# Altium project HBN_Portable_Charger.PrjPcb
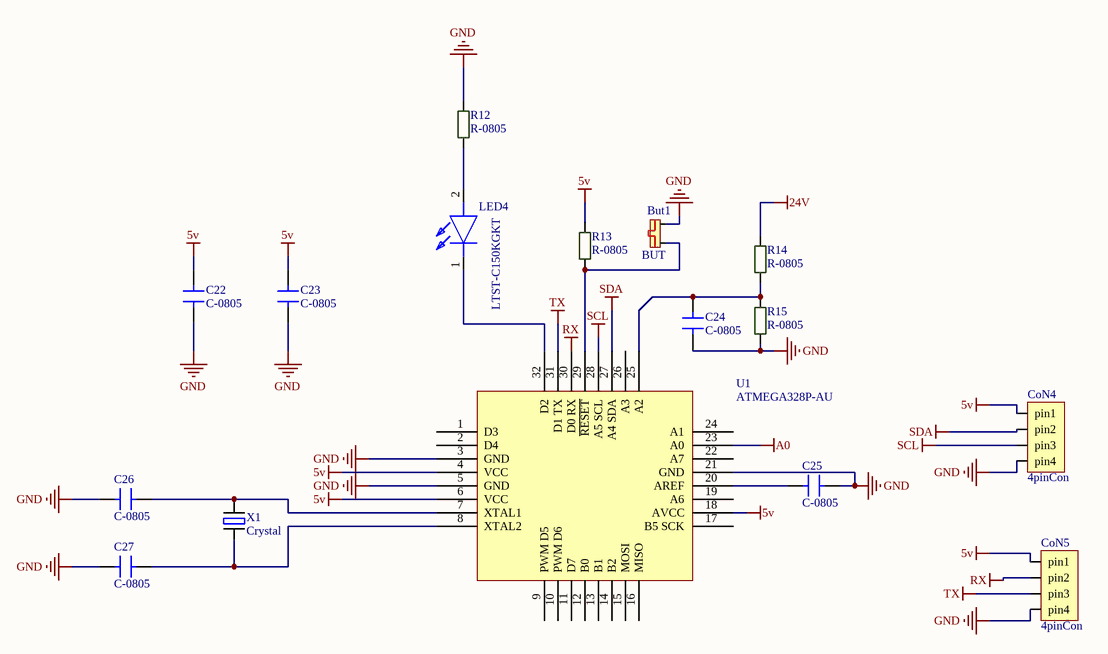
[diagram p0: MCU.SchDoc]
4 sheets, 207 parts. Net scope: global (net labels, ports and power ports of the same name join across sheets).
Board file: Layout.PcbDoc
Sheets:
  MCU.SchDoc
  Inverter.SchDoc
  Power Distrubition.SchDoc
  USB Charger.SchDoc

## Sheet MCU.SchDoc
size A4; SheetNumber: 1; SheetTotal: 4

### Parts
But1  BUT  [ButTON]
C22  C-0805  [C-0805W]
C23  C-0805  [C-0805W]
C24  C-0805  [C-0805W]
C25  C-0805  [C-0805W]
C26  C-0805  [C-0805W]
C27  C-0805  [C-0805W]
CoN4  4pinCon  [4pinCon]
CoN5  4pinCon  [4pinCon]
LED4  LTST-C150KGKT  [LED1206]
R12  R-0805  [R-0805W]
R13  R-0805  [R-0805W]
R14  R-0805  [R-0805W]
R15  R-0805  [R-0805W]
U1  ATMEGA328P-AU  [TQFP80P900X900X120-32N]
X1  Crystal  [crystal]

### Nets
5v: C22.2 C23.2 CoN4.1(pin1) CoN5.1(pin1) R13.2 U1.4(VCC) U1.6(VCC) U1.18(AVCC)
24V: R14.2
A0: U1.23(A0)
GND: But1.2 C22.1 C23.1 C24.1 C25.2 C26.1 C27.1 CoN4.4(pin4) CoN5.4(pin4) R12.2 R15.1 U1.3(GND) U1.5(GND) U1.21(GND)
RX: CoN5.2(pin2) U1.30(D0_RX)
SCL: CoN4.3(pin3) U1.28(A5_SCL)
SDA: CoN4.2(pin2) U1.27(A4_SDA)
TX: CoN5.3(pin3) U1.31(D1_TX)
NetBut1_1: But1.1 R13.1 U1.29(~{RESET})
NetC24_2: C24.2 R14.1 R15.2 U1.25(A2)
NetC25_1: C25.1 U1.20(AREF)
NetC26_2: C26.2 U1.7(XTAL1) X1.1
NetC27_2: C27.2 U1.8(XTAL2) X1.2
NetLED4_1: LED4.1(K) U1.32(D2)
NetLED4_2: LED4.2(A) R12.1

Not connected (* = marked no-connect by the designer): U1 1(D3) 2(D4) 9(PWM_D5) 10(PWM_D6) 11(D7) 12(B0) 13(B1) 14(B2) 15(MOSI) 16(MISO) 17(B5_SCK) 19(A6) 22(A7) 24(A1) 26(A3)

### Library data of the parts
LED4 = LTST-C150KGKT: LED; Manufacturer_Name: Lite-On; Datasheet Link: http://optoelectronics.liteon.com/upload/download/ds22-2000-072/ltst-c150kgkt.pdf; Height: 1.2mm; Manufacturer_Part_Number: LTST-C150KGKT; Mouser Part Number: 859-LTST-C150KGKT; Mouser Price/Stock: https://www.mouser.com/Search/Refine.aspx?Keyword=859-LTST-C150KGKT; RS Part Number: 6920871; RS Price/Stock: https://uk.rs-online.com/web/p/products/6920871
U1 = ATMEGA328P-AU: Microchip Technology ATMEGA328P-AN, 8bit AVR Microcontroller, 20MHz, 32 kB Flash, 32-Pin TQFP
X1 = Crystal: AS49SD-16M-FC160F3-TR

## Sheet Inverter.SchDoc
size A4; SheetNumber: 2; SheetTotal: 4
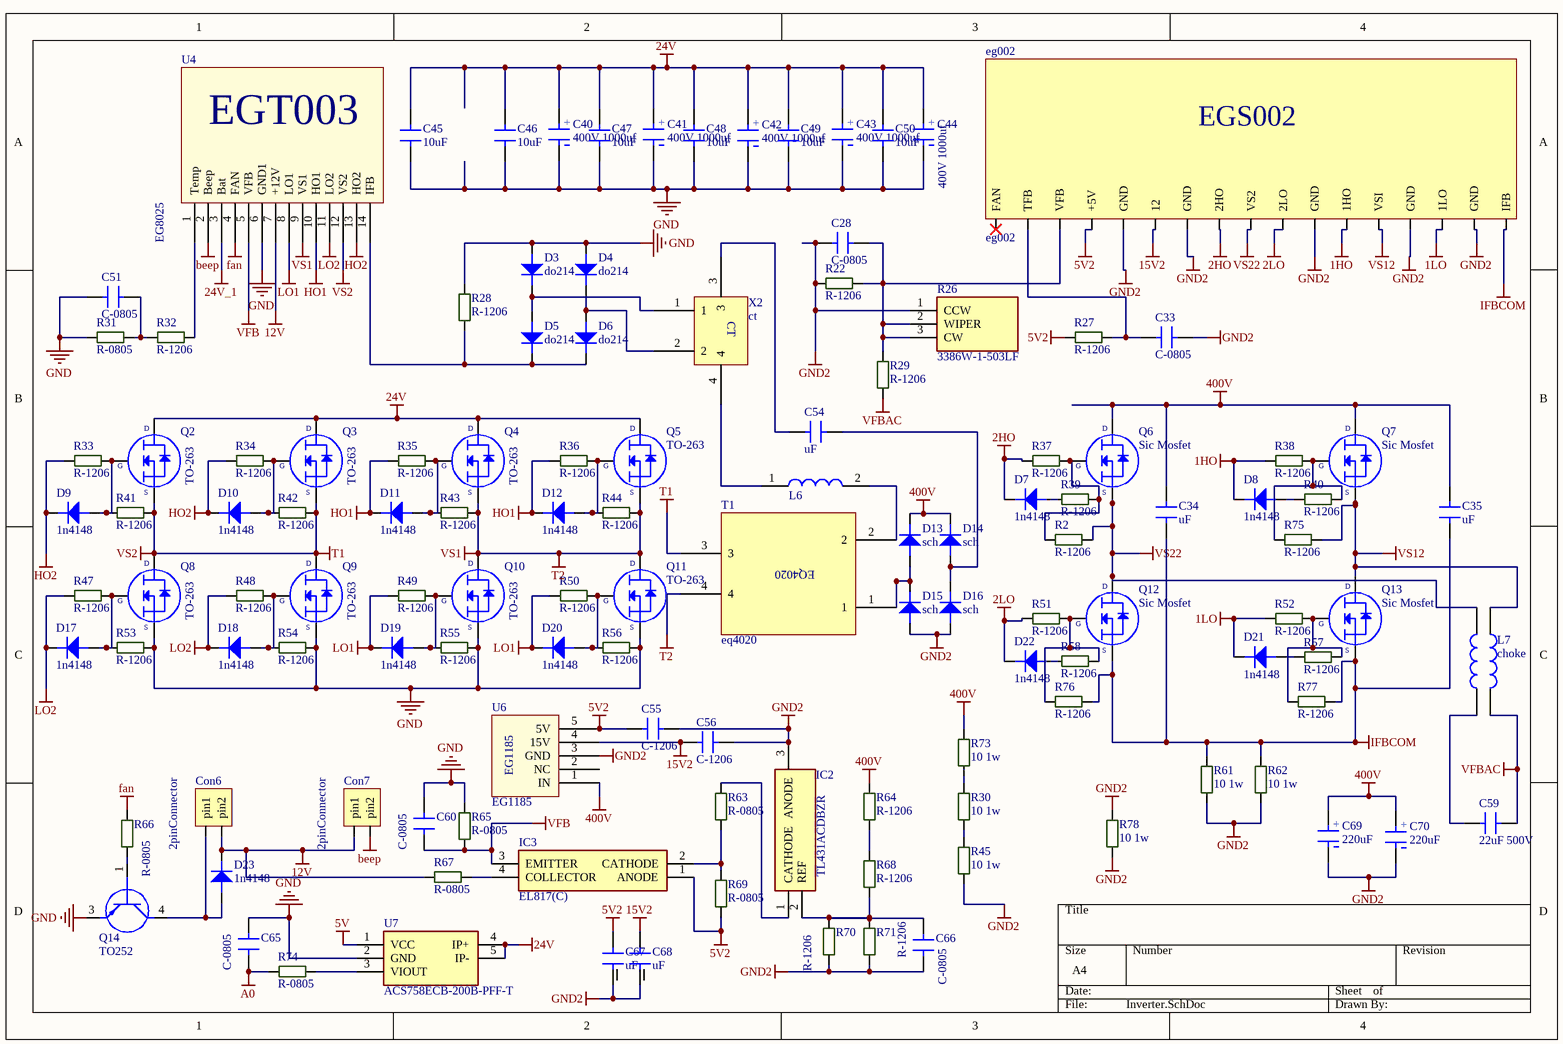
[diagram p1: Inverter.SchDoc]

### Parts
C28  C-0805  [C-0805W]
C33  C-0805  [C-0805W]
C34  uF  [680nF bulk]
C35  uF  [680nF bulk]
C40  400V 1000uf  [CAP_EEETC1C331V]
C41  400V 1000uf  [CAP_EEETC1C331V]
C42  400V 1000uf  [CAP_EEETC1C331V]
C43  400V 1000uf  [CAP_EEETC1C331V]
C44  400V 1000uf  [CAP_EEETC1C331V]
C45  10uF  [C-2220R]
C46  10uF  [C-2220R]
C47  10uF  [C-2220R]
C48  10uF  [C-2220R]
C49  10uF  [C-2220R]
C50  10uF  [C-2220R]
C51  C-0805  [C-0805W]
C54  uF  [680nF bulk]
C55  C-1206  [C-1206W]
C56  C-1206  [C-1206W]
C59  22uF 500V  [CAP.POL 22UF 500VDC - duplicate]
C60  C-0805  [C-0805W]
C65  C-0805  [C-0805W]
C66  C-0805  [C-0805W]
C67  uF  [CapSmdElc]
C68  uF  [CapSmdElc]
C69  220uF  [Koshin]
C70  220uF  [Koshin]
Con6  2pinConnector  [2pinCon]
Con7  2pinConnector  [2pinCon]
D3  do214  [DO-214AC]
D4  do214  [DO-214AC]
D5  do214  [DO-214AC]
D6  do214  [DO-214AC]
D7  1n4148  [SOD123]
D8  1n4148  [SOD123]
D9  1n4148  [SOD123]
D10  1n4148  [SOD123]
D11  1n4148  [SOD123]
D12  1n4148  [SOD123]
D13  sch  [DPAK_TO263 - sch]
D14  sch  [DPAK_TO263 - sch]
D15  sch  [DPAK_TO263 - sch]
D16  sch  [DPAK_TO263 - sch]
D17  1n4148  [SOD123]
D18  1n4148  [SOD123]
D19  1n4148  [SOD123]
D20  1n4148  [SOD123]
D21  1n4148  [SOD123]
D22  1n4148  [SOD123]
D23  1n4148  [SOD123]
eg002  eg002  [eg002]
IC2  TL431ACDBZR  [SOT95P237X112-3N]
IC3  EL817(C)  [DIP762W60P254L458H480Q4N]
L6  inducter_SMPI06050  [inductor]  (value not drawn)
L7  choke  [choke]
Q2  TO-263  [DPAK_TO263]
Q3  TO-263  [DPAK_TO263]
Q4  TO-263  [DPAK_TO263]
Q5  TO-263  [DPAK_TO263]
Q6  Sic Mosfet  [247]
Q7  Sic Mosfet  [247]
Q8  TO-263  [DPAK_TO263]
Q9  TO-263  [DPAK_TO263]
Q10  TO-263  [DPAK_TO263]
Q11  TO-263  [DPAK_TO263]
Q12  Sic Mosfet  [247]
Q13  Sic Mosfet  [247]
Q14  TO252  [D-PAK_TO252AA]
R2  R-1206  [R-1206W]
R22  R-1206  [R-1206W]
R26  3386W-1-503LF  [3386W]
R27  R-1206  [R-1206W]
R28  R-1206  [R-1206W]
R29  R-1206  [R-1206W]
R30  10 1w  [R-2512W]
R31  R-0805  [R-0805W]
R32  R-1206  [R-1206W]
R33  R-1206  [R-1206W]
R34  R-1206  [R-1206W]
R35  R-1206  [R-1206W]
R36  R-1206  [R-1206W]
R37  R-1206  [R-1206W]
R38  R-1206  [R-1206W]
R39  R-1206  [R-1206W]
R40  R-1206  [R-1206W]
R41  R-1206  [R-1206W]
R42  R-1206  [R-1206W]
R43  R-1206  [R-1206W]
R44  R-1206  [R-1206W]
R45  10 1w  [R-2512W]
R47  R-1206  [R-1206W]
R48  R-1206  [R-1206W]
R49  R-1206  [R-1206W]
R50  R-1206  [R-1206W]
R51  R-1206  [R-1206W]
R52  R-1206  [R-1206W]
R53  R-1206  [R-1206W]
R54  R-1206  [R-1206W]
R55  R-1206  [R-1206W]
R56  R-1206  [R-1206W]
R57  R-1206  [R-1206W]
R58  R-1206  [R-1206W]
R61  10 1w  [R-2512W]
R62  10 1w  [R-2512W]
R63  R-0805  [R-0805W]
R64  R-1206  [R-1206W]
R65  R-0805  [R-0805W]
R66  R-0805  [R-0805W]
R67  R-0805  [R-0805W]
R68  R-1206  [R-1206W]
R69  R-0805  [R-0805W]
R70  R-1206  [R-1206W]
R71  R-1206  [R-1206W]
R73  10 1w  [R-2512W]
R74  R-0805  [R-0805W]
R75  R-1206  [R-1206W]
R76  R-1206  [R-1206W]
R77  R-1206  [R-1206W]
R78  10 1w  [R-2512W]
T1  eq4020  [eq4020]
U4  EG8025  [EGT003]
U6  EG1185  [EG1185]
U7  ACS758ECB-200B-PFF-T  [ACS756SCA-050B-PFF-T_2]
X2  ct  [ct]

### Nets
1HO: D8.k eg002.6(1HO) R38.1
1LO: D21.k eg002.3(1LO) R52.1
2HO: D7.k eg002.10(2HO) R37.1
2LO: D22.k eg002.8(2LO) R51.1
5v: U7.1(VCC)
5V2: C55.1 C67.1 eg002.14(+5V) IC3.1(ANODE) R27.1 R69.1 U6.5(5V)
12V: Con6.2(pin2) Con7.1(pin1) D23.k R67.1 U4.7(+12V)
15V2: C56.1 C68.1 eg002.12 U6.4(15V)
24V: C40.1 C41.1 C42.1 C43.1 C44.1 C45.1 C46.1 C47.1 C48.1 C49.1 C50.1 Q2.3 Q3.3 Q4.3 Q5.3 U7.4(IP+) U7.5(IP-)
24V_1: U4.3(Bat)
400V: C34.2 C35.2 C69.2 C70.2 D13.2 D14.2 Q6.2 Q7.2 R64.2 R73.2 U6.1(IN)
A0: C65.1 R74.2
beep: Con7.2(pin2) U4.2(Beep)
fan: R66.1 U4.4(FAN)
GND: C40.2 C41.2 C42.2 C43.2 C44.2 C45.2 C46.2 C47.2 C48.2 C49.2 C50.2 C51.1 C60.2 C65.2 D3.a D4.a Q8.2 Q9.2 Q10.2 Q11.2 Q14.3(E) R28.2 R31.1 R53.2 R54.2 R55.2 R56.2 R65.2 U4.6(GND1) U7.2(GND)
GND2: C28.1 C33.2 C55.2 C56.2 C66.1 C67.2 C68.2 C69.1 C70.1 D15.1 D16.1 eg002.2(GND) eg002.4(GND) eg002.7(GND) eg002.11(GND) eg002.13(GND) IC2.3(ANODE) R22.2 R26.1(CCW) R45.1 R61.1 R62.1 R70.1 R71.1 R78.1 R78.2 U6.3(GND)
HO1: D11.k D12.k R35.1 R36.1 U4.10(HO1)
HO2: D9.k D10.k R33.1 R34.1 U4.13(HO2)
IFBCOM: C34.1 C35.1 eg002.1(IFB) Q12.3 Q13.3 R61.2 R62.2 R76.1 R77.1
LO1: D19.k D20.k R49.1 R50.1 U4.8(LO1)
LO2: D17.k D18.k R47.1 R48.1 U4.11(LO2)
T1: Q2.2 Q3.2 Q8.3 Q9.3 R41.2 R42.2 T1.3 U4.12(VS2)  [also labelled VS2]
T2: Q4.2 Q5.2 Q10.3 Q11.3 R43.2 R44.2 T1.4 U4.9(VS1)  [also labelled VS1]
VFB: C60.1 IC3.3(EMITTER) R65.1 U4.5(VFB)
VFBAC: C59.2 L7.3 R29.1
VS12: eg002.5(VSI) L7.1 Q7.3 Q13.2 R75.1
VS22: eg002.9(VS2) L7.2 Q6.3 Q12.2 R2.1
NetC28_2: C28.2 eg002.15(VFB) R22.1 R26.2(WIPER) R26.3(CW) R29.2
NetC33_1: C33.1 eg002.16(TFB) R27.2
NetC51_2: C51.2 R31.2 R32.1
NetC54_1: C54.1 X2.3
NetC54_2: C54.2 D14.1 D16.2
NetC59_1: C59.1 L7.4
NetC66_2: C66.2 IC2.2(REF) R68.1 R70.2 R71.2
NetCon6_1: Con6.1(pin1) D23.a Q14.4(C)
NetD3_k: D3.k D5.a X2.1
NetD4_k: D4.k D6.a X2.2
NetD5_k: D5.k D6.k R28.1 U4.14(IFB)
NetD7_a: D7.a R39.1
NetD8_a: D8.a R40.1
NetD9_a: D9.a Q2.1 R33.2 R41.1
NetD10_a: D10.a Q3.1 R34.2 R42.1
NetD11_a: D11.a Q4.1 R35.2 R43.1
NetD12_a: D12.a Q5.1 R36.2 R44.1
NetD13_1: D13.1 D15.2 T1.1
NetD17_a: D17.a Q8.1 R47.2 R53.1
NetD18_a: D18.a Q9.1 R48.2 R54.1
NetD19_a: D19.a Q10.1 R49.2 R55.1
NetD20_a: D20.a Q11.1 R50.2 R56.1
NetD21_a: D21.a R57.1
NetD22_a: D22.a R58.1
NetIC2_1: IC2.1(CATHODE) R63.1
NetIC3_2: IC3.2(CATHODE) R63.2 R69.2
NetIC3_4: IC3.4(COLLECTOR) R67.2
NetL6_1: L6.1 X2.4
NetL6_2: L6.2 T1.2
NetQ6_1: Q6.1 R2.2 R37.2 R39.2
NetQ7_1: Q7.1 R38.2 R40.2 R75.2
NetQ12_1: Q12.1 R51.2 R58.2 R76.2
NetQ13_1: Q13.1 R52.2 R57.2 R77.2
NetQ14_1: Q14.1(B) R66.2
NetR30_1: R30.1 R45.2
NetR30_2: R30.2 R73.1
NetR32_2: R32.2 U4.1(Temp)
NetR64_1: R64.1 R68.2
NetR74_1: R74.1 U7.3(VIOUT)

Not connected (* = marked no-connect by the designer): eg002 17(FAN)*; U6 2(NC)

### Notes on the sheet
- (in symbol Aluminum Electrolytic Capacitors) +
- (in symbol CAP.EL.220uF 500V) +
- (in symbol ct) CT
- (in symbol eg002) EGS002
- (in symbol eq4020) EQ4020
- (in symbol Sic Mosfet To247) D; G; S
- (in symbol TO-263_1) D; G; S

### Library data of the parts
C34 C35 C54 = 680
C40-C44 = Aluminum Electrolytic Capacitors: Manufacturer: Nichicon; Manufacturer Part Number: LKS1J472MESZ; Capacitance: 4.7mF; Voltage Rating: 63V; Tolerance: 20%; Ripple Current: 3A; Life (Hours): 1000Hour; Supplier 1: Mouser; RoHS: Yes; Mount: Through Hole; Case/Package: Radial; Min Operating Temperature: -40°C; Max Operating Temperature: 85°C; Package Quantity: 250; Packaging: Bulk; Voltage Rating (DC): 63V; Termination: Snap in; Diameter: 22mm; Length: 45mm; Lead Pitch: 0.394inch; Height - Seated (Max): 1.772inch; Supplier Part Number 1: 647-LKS1J472MESZ; ComponentLink2Description: https://www.ozdisan.com/pasif-komponentler/kondansatorler/aluminyum-kondansatorler/PKL5-063V472MM450; ComponentLink2URL: https://www.ozdisan.com/pasif-komponentler/kondansatorler/aluminyum-kondansatorler/PKL5-063V472MM450
C45-C50 = Cap2220: 2220; Özdisan Part Number: CL31B475KBHNNNE; Manufacturer: SAMSUNG; Link: https://www.ozdisan.com/pasif-komponentler/kondansatorler/smd-kondansatorler-mlcc/CL31B475KBHNNNE; Price: 0,10407
C59 = CAP.POL 22UF 500VDC: ComponentLink1Description: https://www.ozdisan.com/pasif-komponentler/kondansatorler/film-kondansatorler/C3D2H226JB00C00; ComponentLink1URL: https://www.ozdisan.com/pasif-komponentler/kondansatorler/film-kondansatorler/C3D2H226JB00C00
C67 C68 = CAPSMDELC
C69 C70 = CAP.EL.220uF 500V: ComponentLink1Description: https://www.ozdisan.com/pasif-komponentler/kondansatorler/aluminyum-kondansatorler/K055002210PM0E040; ComponentLink1URL: https://www.ozdisan.com/pasif-komponentler/kondansatorler/aluminyum-kondansatorler/K055002210PM0E040
D3-D6 = do214: DIODE FAST SWITCHING Single 150mA 75V SMT SOD323
D7-D12 D17-D23 = 1N4148W-E3-18: Diode Small Signal Switching 100V 0.15A 2-Pin SOD-123 T/R; Manufacturer: Vishay; Recovery Time: 4ns; Max Power Dissipation: 350mW; Forward Current: 150mA; Max Surge Current: 2A; Forward Voltage: 1.2V; Max Reverse Leakage Current: 5uA; Element Configuration: Single; Max Reverse Voltage (DC): 75V; Peak Reverse Current: 100uA; Supplier 1: Allied Electronics; Manufacturer Part Number: 1N4148W-E3-18; RoHS: Yes; Stock 1: 6838; Pricing 1: 1 = 0.03900, 25 = 0.03800, 100 = 0.03600, 250 = 0.03400, 500 = 0.03200, 1000 = 0.03100, 2500 = 0.02900 (USD); Mount: Surface Mount; Number of Pins: 2; Weight: 0.000363oz; Contact Plating: Tin; Min Operating Temperature: -55°C; Max Operating Temperature: 150°C; Packaging: Tape and Reel; Package Quantity: 10000; Average Rectified Current: 150mA; Reverse Recovery Time: 4ns; Power Dissipation: 350mW; Max Repetitive Reverse Voltage (Vrrm): 100V; Peak Non-Repetitive Surge Current: 2A; Length: 2.85mm; Height: 1.25mm; Width: 1.7mm; Radiation Hardening: No; Lead Free: Lead Free; ComponentLink1URL: https://datasheet.ciiva.com/29885/1n4148w-29885941.pdf?src-supplier=Avnet; ComponentLink1Description: https://datasheet.ciiva.com/29885/1n4148w-29885941.pdf?src-supplier=Avnet; ComponentLink2URL: https://datasheet.ciiva.com/29593/1n4148w-29593113.pdf?src-supplier=Digi-Key; ComponentLink2Description: https://datasheet.ciiva.com/29593/1n4148w-29593113.pdf?src-supplier=Digi-Key; ComponentLink3URL: https://datasheet.ciiva.com/29593/1n4148w-29593111.pdf?src-supplier=Digi-Key; ComponentLink3Description: https://datasheet.ciiva.com/29593/1n4148w-29593111.pdf?src-supplier=Digi-Key; ComponentLink4URL: https://datasheet.ciiva.com/29593/1n4148w-29593112.pdf?src-supplier=Digi-Key; ComponentLink4Description: https://datasheet.ciiva.com/29593/1n4148w-29593112.pdf?src-supplier=Digi-Key; Supplier Part Number 1: 70061597
D13-D16 = sch: DIODE FAST SWITCHING Single 150mA 75V SMT SOD323
IC2 = TL431ACDBZR: Integrated Circuit; Manufacturer_Name: Texas Instruments; Datasheet Link: https://datasheet.datasheetarchive.com/originals/distributors/SFDatasheet-6/sf-000131849.pdf; Manufacturer_Part_Number: TL431ACDBZR; Mouser Part Number: 595-TL431ACDBZR; Mouser Price/Stock: https://www.mouser.co.uk/ProductDetail/Texas-Instruments/TL431ACDBZR?qs=odmYgEirbwzMcBuFx%2Fo8hQ%3D%3D; Arrow Part Number: TL431ACDBZR; Arrow Price/Stock: https://www.arrow.com/en/products/tl431acdbzr/texas-instruments?region=nac
IC3 = EL817(C): Integrated Circuit; Manufacturer_Name: Everlight; Datasheet Link: https://componentsearchengine.com/Datasheets/1/EL817(C).pdf; Height: 4.8mm; Manufacturer_Part_Number: EL817(C); Mouser Part Number: 638-EL817C; Mouser Price/Stock: https://www.mouser.com/Search/Refine.aspx?Keyword=638-EL817C
Q2-Q5 Q8-Q11 = TO-263_1
Q6 Q7 Q12 Q13 = Sic Mosfet To247
R26 = 3386W-1-503LF: Resistor; Manufacturer_Name: Bourns; Datasheet Link: http://www.bourns.com/docs/Product-Datasheets/3386.pdf; Manufacturer_Part_Number: 3386W-1-503LF; Mouser Part Number: 652-3386W-1-503LF; Mouser Price/Stock: https://www.mouser.co.uk/ProductDetail/Bourns/3386W-1-503LF?qs=aZhnFHiXcUS20GqScAFfrw%3D%3D; Arrow Part Number: 3386W-1-503LF; Arrow Price/Stock: https://www.arrow.com/en/products/3386w-1-503lf/bourns
R30 R45 R61 R62 R73 R78 = R-2512
U4 = EGT003
U7 = ACS758ECB-200B-PFF-T: Undefined or Miscellaneous; Manufacturer_Name: Allegro Microsystems; Datasheet Link: http://www.farnell.com/datasheets/926109.pdf; Manufacturer_Part_Number: ACS758ECB-200B-PFF-T; Arrow Part Number: ACS758ECB-200B-PFF-T; Arrow Price/Stock: https://www.arrow.com/en/products/acs758ecb-200b-pff-t/allegro-microsystems

## Sheet Power Distrubition.SchDoc
size A4; SheetNumber: 3; SheetTotal: 4
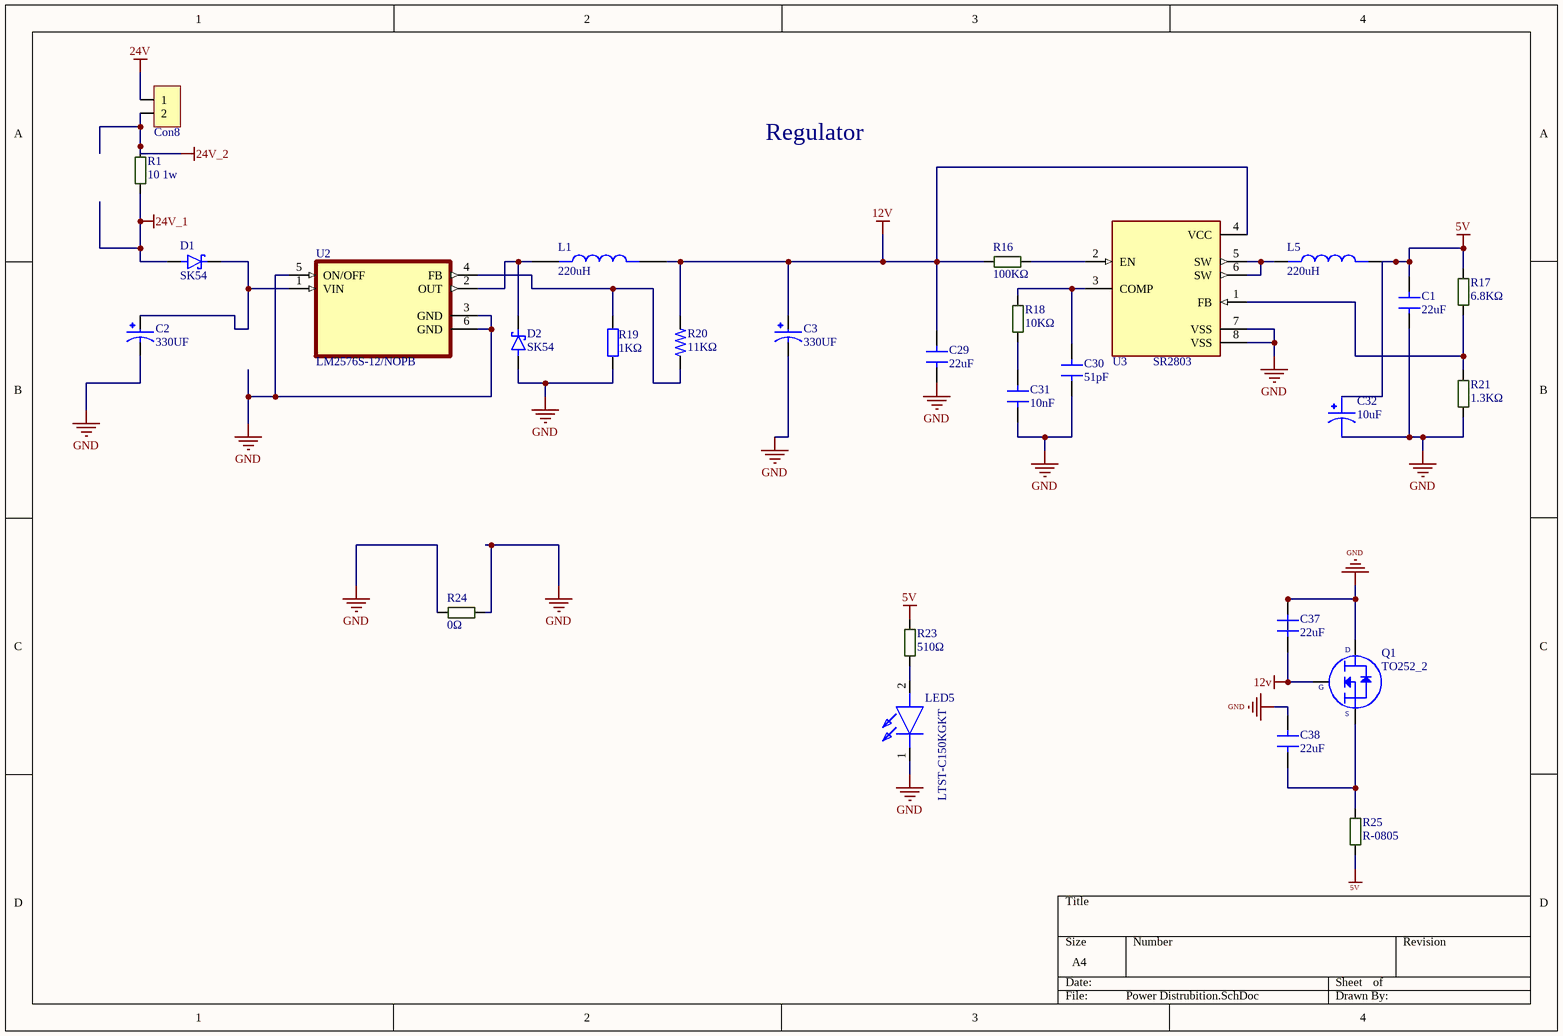
[diagram p2: Power Distrubition.SchDoc]

### Parts
C1  22uF  [C-0805]
C2  330UF  [CAP_EEETC1C331V]
C3  330UF  [CAP_EEETC1C331V]
C29  22uF  [C-0805]
C30  51pF  [C-0603W]
C31  10nF  [C-0805]
C32  10uF  [CapSmdElc]
C37  22uF  [C-0805]
C38  22uF  [C-0805]
Con8  Connector2_1  [Conn]  (value not drawn)
D1  SK54  [DIOM7959X265N]
D2  SK54  [DIOM7959X265N]
L1  220uH  [IND_MDH12577C-101MA=P3]
L5  220uH  [IND_MDH12577C-101MA=P3]
LED5  LTST-C150KGKT  [LED1206]
Q1  TO252_2  [TO-252]
R1  10 1w  [R-2512]
R16  100KΩ  [R-0805]
R17  6.8KΩ  [R-0603R]
R18  10KΩ  [R-0805]
R19  Deger: 1KΩ  [R-0805]  (hidden comment: RES SMD 1K OHM 1% 1/8W 0805)
R20  11KΩ  [R-0805]
R21  1.3KΩ  [R-0603R]
R23  510Ω  [R-0603R]
R24  0Ω  [R-2512]
R25  R-0805  [R-0805W]
U2  LM2576S-12/NOPB  [VREG_TPS79625KTTR]
U3  SR2803  [SOP127P600X175-8N]

### Nets
5v: C1.2 C32.1 L5.2 R17.2 R23.2 R25.1
12V: C3.1 C29.2 C37.1 L1.2 Q1.1 R16.2 R20.2 U3.4(VCC)
24V: Con8.1
24V_1: D1.A R1.1
24V_2: Con8.2 R1.2
GND: C1.1 C2.2 C3.2 C29.1 C30.1 C31.1 C32.2 C37.2 C38.2 D2.A LED5.1(K) Q1.4 R19.1 R21.1 R24.1 R24.2 U2.3(GND) U2.5(ON/OFF) U2.6(GND) U3.7(VSS) U3.8(VSS)
NetC2_1: C2.1 D1.C(K) U2.1(VIN)
NetC30_2: C30.2 R18.2 U3.3(COMP)
NetC31_2: C31.2 R18.1
NetC38_1: C38.1 Q1.3 R25.2
NetD2_C: D2.C(K) L1.1 U2.2(OUT)
NetL5_1: L5.1 U3.5(SW) U3.6(SW)
NetLED5_2: LED5.2(A) R23.1
NetR16_1: R16.1 U3.2(EN)
NetR17_1: R17.1 R21.2 U3.1(FB)
NetR19_2: R19.2 R20.1 U2.4(FB)

### Notes on the sheet
- Regulator
- (in symbol TO252_2) D; G; S

### Library data of the parts
C1 C29 C31 C37 C38 = C-0805
C2 C3 = CAP 330UF SMD: CAP ALUM 330UF 20% 16V SMD; MP: EEE-TC1C331V; MF: Panasonic Electronic Components; Value: *; Package: RADIAL-2 Panasonic; Availability: In Stock; SnapEDA_Link: https://www.snapeda.com/parts/EEE-TC1C331V/Panasonic/view-part/6178283/?ref=snap; Price: None; Purchase-URL: https://pricing.snapeda.com/search/part/EEE-TC1C331V/?ref=eda; Check_prices: https://www.snapeda.com/parts/EEE-TC1C331V/Panasonic/view-part/6178283/?ref=eda
C30 = C-0603
C32 = 100 uF Electr Cap
D1 D2 = SK54: Diode Schottky 40V 5A Surface Mount DO-214AA (SMB); MP: MBRS320T3G; MF: ON Semiconductor; Package: DO-214 ON Semiconductor; Availability: Good; Arrow_Electronics-Purchase-URL: https://snapeda.com/shop?store=Arrow+Electronics&id=432205; SnapEDA_Link: https://www.snapeda.com/parts/MBRS320T3G/ON%20Semiconductor/view-part/432205/?ref=snap; DigiKey-Purchase-URL: https://snapeda.com/shop?store=DigiKey&id=432205; Mouser-Purchase-URL: https://snapeda.com/shop?store=Mouser&id=432205; Value: *; Price: None
L1 L5 = 220uH Inductor SMD: Inductor Power Shielded Wirewound 220uH 20% 100KHz Ferrite 1.1A 0.325Ohm DCR 5049 Automotive T/R; MP: MDH12577C-101MA=P3; Package: None; Price: None; Value: *; Availability: Unavailable
LED5 = LTST-C150KGKT: LED; Manufacturer_Name: Lite-On; Datasheet Link: http://optoelectronics.liteon.com/upload/download/ds22-2000-072/ltst-c150kgkt.pdf; Height: 1.2mm; Manufacturer_Part_Number: LTST-C150KGKT; Mouser Part Number: 859-LTST-C150KGKT; Mouser Price/Stock: https://www.mouser.com/Search/Refine.aspx?Keyword=859-LTST-C150KGKT; RS Part Number: 6920871; RS Price/Stock: https://uk.rs-online.com/web/p/products/6920871
Q1 = TO252_2: Manufacturer: Infineon; Manufacturer Part Number: IRF3205STRLPBF; Drain to Source Voltage (Vdss): 55V; Continuous Drain Current (ID): 110A; Rds On Max: 8mR; Input Capacitance: 3.247nF; Max Power Dissipation: 200W; Turn-Off Delay Time: 50ns; Turn-On Delay Time: 14ns; Gate to Source Voltage (Vgs): 20V; Threshold Voltage: 4V; Supplier 1: Digi-Key; RoHS: Yes; Stock 1: 3281; Pricing 1: 1 = 1,84000, 10 = 1,66600, 100 = 1,33840 (USD); Mount: Surface Mount; Case/Package: D2PAK; Number of Pins: 3; Min Operating Temperature: -55°C; Max Operating Temperature: 175°C; Packaging: Cut Tape; Power Dissipation: 200W; Drain to Source Resistance: 8mR; Drain to Source Breakdown Voltage: 55V; Length: 0.42inch; Height: 0.19inch; Width: 0.38inch; REACH SVHC: No SVHC; Lead Free: Lead Free; ComponentLink1URL: https://www.alliedelec.com/m/d/b8827ca43655240244f0cc5c2198e6b1.pdf?src-supplier=Allied+Electronics; ComponentLink1Description: https://www.alliedelec.com/m/d/b8827ca43655240244f0cc5c2198e6b1.pdf?src-supplier=Allied+Electronics; ComponentLink2URL: https://www.infineon.com/dgdl/irf3205spbf.pdf?fileId=5546d462533600a4015355defac9190c&src-supplier=Digi-Key; ComponentLink2Description: https://www.infineon.com/dgdl/irf3205spbf.pdf?fileId=5546d462533600a4015355defac9190c&src-supplier=Digi-Key; ComponentLink3URL: http://www.infineon.com/dgdl/irf3205spbf.pdf?fileId=5546d462533600a4015355defac9190c&src-supplier=Digi-Key; ComponentLink3Description: http://www.infineon.com/dgdl/irf3205spbf.pdf?fileId=5546d462533600a4015355defac9190c&src-supplier=Digi-Key; ComponentLink4URL: http://www.farnell.com/datasheets/1884183.pdf?src-supplier=Element14; ComponentLink4Description: http://www.farnell.com/datasheets/1884183.pdf?src-supplier=Element14; Supplier Part Number 1: IRF3205STRLPBFCT-ND
R1 = R-2512
R16 R18 = R-0805
R17 R21 R23 = R-0603
R19 = 1K 0805: 1 kOhms ±1% 0.125W, 1/8W Chip Resistor 0805 (2012 Metric) Moisture Resistant Thick Film; Cins: Direnc; Uretici Kodu: RC0805FR-071KL; Kılıf: 0805; -Sicaklik: -55; +Sicaklik: +155; Lehim Yöntemi: SMD; MSL: 1 (Unlimited)
R20 = RES 11KΩ SMD: THICK FILM RESISTOR, 11KOHM, 125mW, 5%; MP: CRCW080511K0JNEA; Package: None; Price: None; Value: *; Availability: Unavailable
R24 = R-2512: 10 1w
U2 = LM2576S-12/NOPB: SIMPLE SWITCHER&reg; 40V, 3A Low Component Count Step-Down Regulator 5-DDPAK/TO-263 -40 to 125; MF: Texas Instruments; Availability: Warning; SnapEDA_Link: https://www.snapeda.com/parts/LM2576S-12/NOPB/Texas%20Instruments/view-part/470772/?ref=snap; Mouser-Purchase-URL: https://snapeda.com/shop?store=Mouser&id=470772; Texas_Instruments-Purchase-URL: https://snapeda.com/shop?store=Texas+Instruments&id=470772; Value: *; Price: None; Package: TO-263-5 Texas Instruments; DigiKey-Purchase-URL: https://snapeda.com/shop?store=DigiKey&id=470772; MP: LM2576S-12/NOPB; BuyPart: https://www.snapeda.com/parts/LM2576S-12/NOPB/Texas%20Instruments/view-part/470772/?ref=eda
U3 = SR2803: 330KHZ, 3A SYNCHRONOUS / BUCK CONTROLLER; MF: Taiwan Semiconductor Corporation; MP: TS2509CS RLG; Package: SOP-8 Taiwan Semiconductor; Check_prices: https://www.snapeda.com/parts/TS2509CS%20RLG/Taiwan+Semiconductor+Corporation/view-part/?ref=eda; Value: *; Price: None; Availability: In Stock; SnapEDA_Link: https://www.snapeda.com/parts/TS2509CS%20RLG/Taiwan+Semiconductor+Corporation/view-part/?ref=snap
Con8 = Connector2_1: System: Connector

## Sheet USB Charger.SchDoc
size A4; SheetNumber: 4; SheetTotal: 4
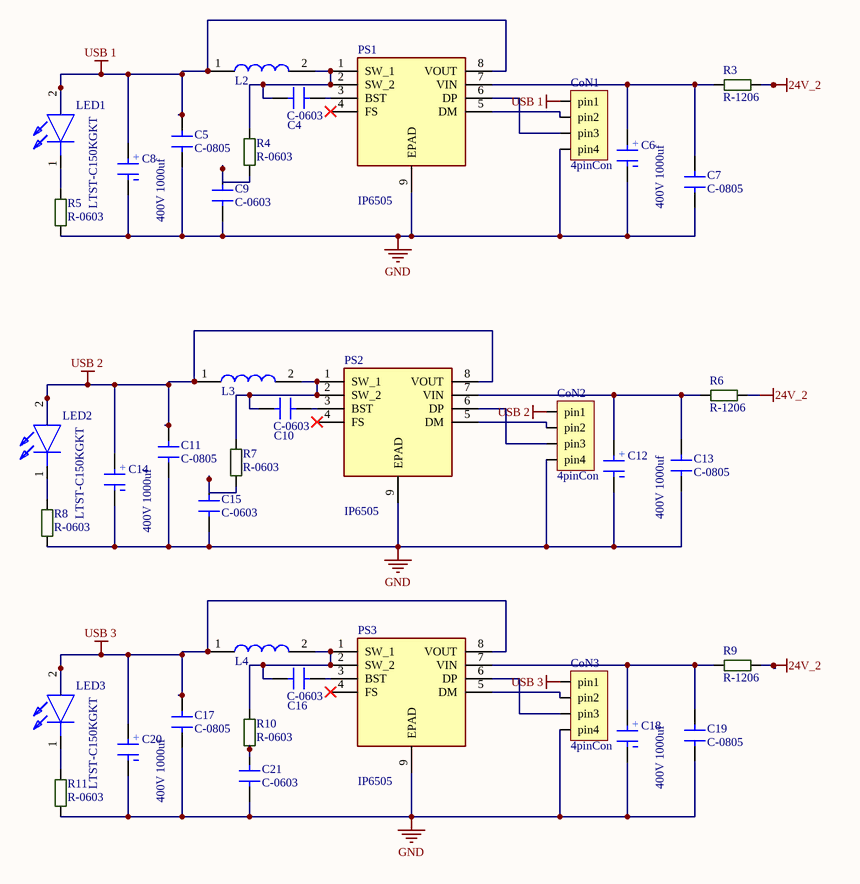
[diagram p3: USB Charger.SchDoc]

### Parts
C4  C-0603  [C-0603W]
C5  C-0805  [C-0805W]
C6  400V 1000uf  [CAP_EEETC1C331V]
C7  C-0805  [C-0805W]
C8  400V 1000uf  [CAP_EEETC1C331V]
C9  C-0603  [C-0603W]
C10  C-0603  [C-0603W]
C11  C-0805  [C-0805W]
C12  400V 1000uf  [CAP_EEETC1C331V]
C13  C-0805  [C-0805W]
C14  400V 1000uf  [CAP_EEETC1C331V]
C15  C-0603  [C-0603W]
C16  C-0603  [C-0603W]
C17  C-0805  [C-0805W]
C18  400V 1000uf  [CAP_EEETC1C331V]
C19  C-0805  [C-0805W]
C20  400V 1000uf  [CAP_EEETC1C331V]
C21  C-0603  [C-0603W]
CoN1  4pinCon  [4pinCon]
CoN2  4pinCon  [4pinCon]
CoN3  4pinCon  [4pinCon]
L2  inducter_SMPI06050  [inductor]  (value not drawn)
L3  inducter_SMPI06050  [inductor]  (value not drawn)
L4  inducter_SMPI06050  [inductor]  (value not drawn)
LED1  LTST-C150KGKT  [LED1206]
LED2  LTST-C150KGKT  [LED1206]
LED3  LTST-C150KGKT  [LED1206]
PS1  IP6505  [IP6505]
PS2  IP6505  [IP6505]
PS3  IP6505  [IP6505]
R3  R-1206  [R-1206W]
R4  R-0603  [R-0603W]
R5  R-0603  [R-0603W]
R6  R-1206  [R-1206W]
R7  R-0603  [R-0603W]
R8  R-0603  [R-0603W]
R9  R-1206  [R-1206W]
R10  R-0603  [R-0603W]
R11  R-0603  [R-0603W]

### Nets
24V_2: R3.1 R6.1 R9.1
GND: C5.1 C6.2 C7.1 C8.2 C9.1 C11.1 C12.2 C13.1 C14.2 C15.1 C17.1 C18.2 C19.1 C20.2 C21.1 CoN1.4(pin4) CoN2.4(pin4) CoN3.4(pin4) PS1.9(EPAD) PS2.9(EPAD) PS3.9(EPAD) R5.1 R8.1 R11.1
USB 1: C5.2 C8.1 CoN1.1(pin1) L2.1 LED1.2(A) PS1.8(VOUT)
USB 2: C11.2 C14.1 CoN2.1(pin1) L3.1 LED2.2(A) PS2.8(VOUT)
USB 3: C17.2 C20.1 CoN3.1(pin1) L4.1 LED3.2(A) PS3.8(VOUT)
NetC4_1: C4.1 PS1.3(BST)
NetC4_2: C4.2 L2.2 PS1.1(SW_1) PS1.2(SW_2) R4.2
NetC6_1: C6.1 C7.2 PS1.7(VIN) R3.2
NetC9_2: C9.2 R4.1
NetC10_1: C10.1 PS2.3(BST)
NetC10_2: C10.2 L3.2 PS2.1(SW_1) PS2.2(SW_2) R7.2
NetC12_1: C12.1 C13.2 PS2.7(VIN) R6.2
NetC15_2: C15.2 R7.1
NetC16_1: C16.1 PS3.3(BST)
NetC16_2: C16.2 L4.2 PS3.1(SW_1) PS3.2(SW_2) R10.2
NetC18_1: C18.1 C19.2 PS3.7(VIN) R9.2
NetC21_2: C21.2 R10.1
NetCoN1_2: CoN1.2(pin2) PS1.5(DM)
NetCoN1_3: CoN1.3(pin3) PS1.6(DP)
NetCoN2_2: CoN2.2(pin2) PS2.5(DM)
NetCoN2_3: CoN2.3(pin3) PS2.6(DP)
NetCoN3_2: CoN3.2(pin2) PS3.5(DM)
NetCoN3_3: CoN3.3(pin3) PS3.6(DP)
NetLED1_1: LED1.1(K) R5.2
NetLED2_1: LED2.1(K) R8.2
NetLED3_1: LED3.1(K) R11.2

Not connected (* = marked no-connect by the designer): PS1 4(FS)*; PS2 4(FS)*; PS3 4(FS)*

### Notes on the sheet
- (in symbol Aluminum Electrolytic Capacitors) +

### Library data of the parts
C6 C8 C12 C14 C18 C20 = Aluminum Electrolytic Capacitors: as C40 on sheet Inverter; Supplier 1: Mouser; RoHS: Yes; Mount: Through Hole; Case/Package: Radial; Min Operating Temperature: -40°C; Max Operating Temperature: 85°C; Package Quantity: 250; Packaging: Bulk; Voltage Rating (DC): 63V; Termination: Snap in; Diameter: 22mm; Length: 45mm; Lead Pitch: 0.394inch; Height - Seated (Max): 1.772inch; Supplier Part Number 1: 647-LKS1J472MESZ; ComponentLink2Description: https://www.ozdisan.com/pasif-komponentler/kondansatorler/aluminyum-kondansatorler/PKL5-063V472MM450; ComponentLink2URL: https://www.ozdisan.com/pasif-komponentler/kondansatorler/aluminyum-kondansatorler/PKL5-063V472MM450
LED1-LED3 = LTST-C150KGKT: LED; Manufacturer_Name: Lite-On; Datasheet Link: http://optoelectronics.liteon.com/upload/download/ds22-2000-072/ltst-c150kgkt.pdf; Height: 1.2mm; Manufacturer_Part_Number: LTST-C150KGKT; Mouser Part Number: 859-LTST-C150KGKT; Mouser Price/Stock: https://www.mouser.com/Search/Refine.aspx?Keyword=859-LTST-C150KGKT; RS Part Number: 6920871; RS Price/Stock: https://uk.rs-online.com/web/p/products/6920871
PS1-PS3 = IP6505: Power Supply; Manufacturer_Name: INJOINIC; Datasheet Link: https://datasheet.lcsc.com/szlcsc/INJOINIC-IP6505_C188335.pdf; Height: 1.65mm; Manufacturer_Part_Number: IP6505

## Nets that join several sheets
5v: MCU (8 pins), Inverter (U7.1), Power Distrubition (6 pins)
12V: Inverter (5 pins), Power Distrubition (8 pins)
24V: MCU (R14.2), Inverter (17 pins), Power Distrubition (Con8.1)
24V_1: Inverter (U4.3), Power Distrubition (D1.A R1.1)
24V_2: Power Distrubition (Con8.2 R1.2), USB Charger (R3.1 R6.1 R9.1)
A0: MCU (U1.23), Inverter (C65.1 R74.2)
GND: MCU (14 pins), Inverter (30 pins), Power Distrubition (21 pins), USB Charger (24 pins)